# EAGLE schematic Paulo V2 (EAGLE 7.6.0)
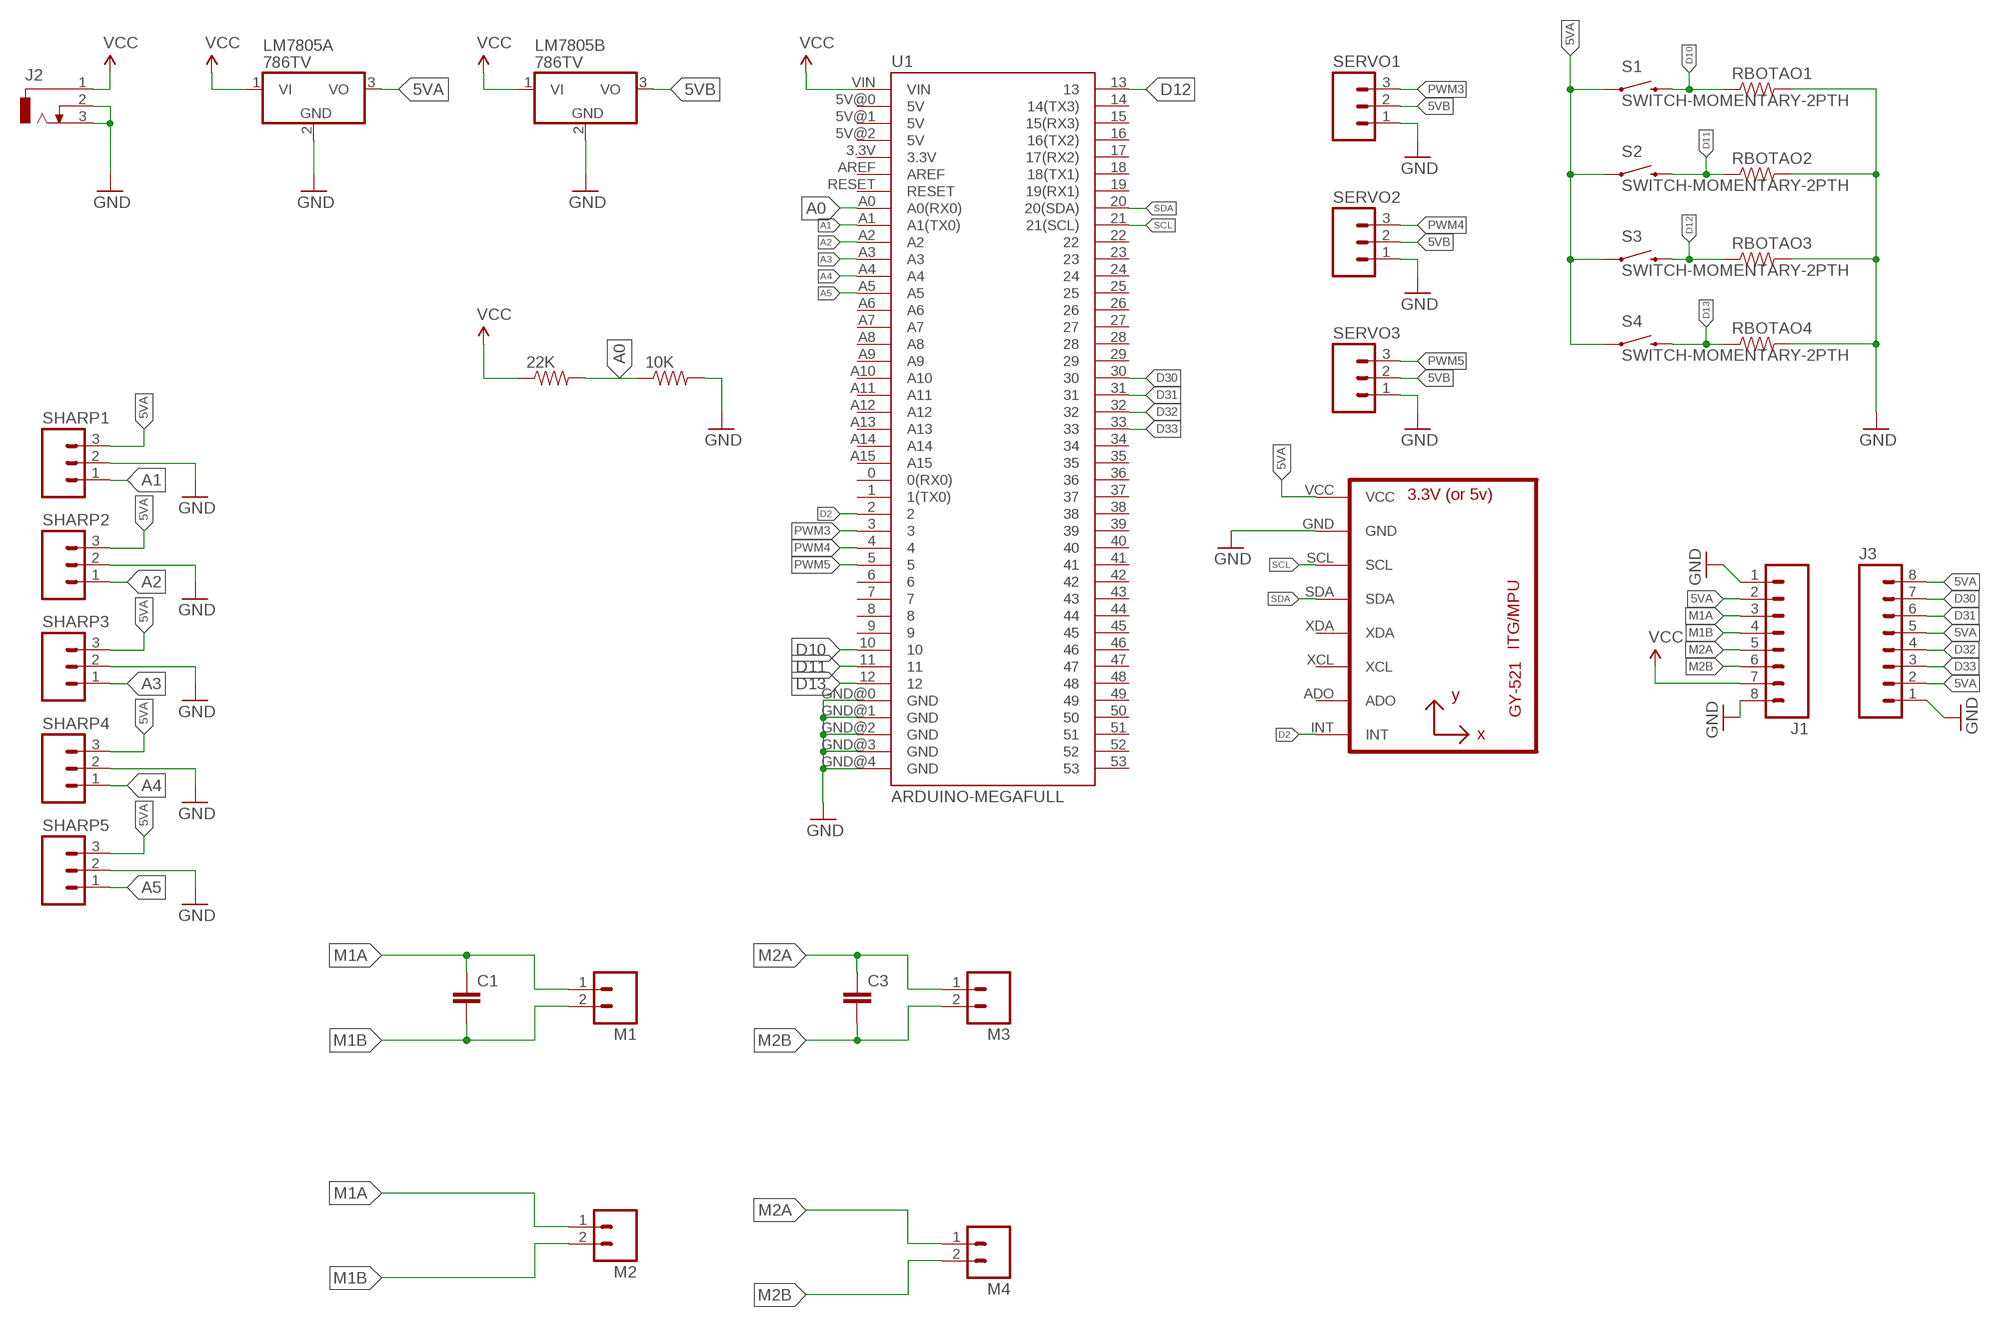
[diagram p0: schematic, sheet 1]

## Parts
10K  RESISTOREZ  [AXIAL-0.3EZ]
22K  RESISTOREZ  [AXIAL-0.3EZ]
C1  CAPEZ  [CAP-PTH-SMALLEZ]
C3  CAPEZ  [CAP-PTH-SMALLEZ]
J1  M08NO_SILK  [1X08_PIN1_NO_SILK]
J2  DCJ0303  [DCJ0303]
J3  M08NO_SILK  [1X08_PIN1_NO_SILK]
LM7805A  786TV  [TO220V]
LM7805B  786TV  [TO220V]
M1  M02JST-PTH-VERT  [JST-2-PTH-VERT]
M2  M02JST-PTH-VERT  [JST-2-PTH-VERT]
M3  M02JST-PTH-VERT  [JST-2-PTH-VERT]
M4  M02JST-PTH-VERT  [JST-2-PTH-VERT]
RBOTAO1  RESISTOREZ  [AXIAL-0.3EZ]
RBOTAO2  RESISTOREZ  [AXIAL-0.3EZ]
RBOTAO3  RESISTOREZ  [AXIAL-0.3EZ]
RBOTAO4  RESISTOREZ  [AXIAL-0.3EZ]
S1  SWITCH-MOMENTARY-2PTH  [TACTILE-PTH]
S2  SWITCH-MOMENTARY-2PTH  [TACTILE-PTH]
S3  SWITCH-MOMENTARY-2PTH  [TACTILE-PTH]
S4  SWITCH-MOMENTARY-2PTH  [TACTILE-PTH]
SERVO1  M03LONGPADS  [1X03_LONGPADS]
SERVO2  M03LONGPADS  [1X03_LONGPADS]
SERVO3  M03LONGPADS  [1X03_LONGPADS]
SHARP1  M03LONGPADS  [1X03_LONGPADS]
SHARP2  M03LONGPADS  [1X03_LONGPADS]
SHARP3  M03LONGPADS  [1X03_LONGPADS]
SHARP4  M03LONGPADS  [1X03_LONGPADS]
SHARP5  M03LONGPADS  [1X03_LONGPADS]
U1  ARDUINO-MEGAFULL  [ARDUINO_MEGA]
U2  GY-521MPU6050  [GY-521]

## Nets
5VA: J1.2 J3.2 J3.5 J3.8 LM7805A.3(VO) S1.1 S2.1 S3.1 S4.1 SHARP1.3 SHARP2.3 SHARP3.3 SHARP4.3 SHARP5.3 U2.VCC
5VB: LM7805B.3(VO) SERVO1.2 SERVO2.2 SERVO3.2
A0: 10K.P$1 22K.P$2 U1.A0(A0(RX0))
A1: SHARP1.1 U1.A1(A1(TX0))
A2: SHARP2.1 U1.A2
A3: SHARP3.1 U1.A3
A4: SHARP4.1 U1.A4
A5: SHARP5.1 U1.A5
D2: U1.2 U2.INT
D10: RBOTAO1.P$1 S1.3 U1.10
D11: RBOTAO2.P$1 S2.3 U1.11
D12: RBOTAO3.P$1 S3.3 U1.13
D13: RBOTAO4.P$1 S4.3 U1.12
D30: J3.7 U1.30
D31: J3.6 U1.31
D32: J3.4 U1.32
D33: J3.3 U1.33
GND: 10K.P$2 J1.1 J1.8 J2.2 J2.3 J3.1 LM7805A.2(GND) LM7805B.2(GND) RBOTAO1.P$2 RBOTAO2.P$2 RBOTAO3.P$2 RBOTAO4.P$2 SERVO1.1 SERVO2.1 SERVO3.1 SHARP1.2 SHARP2.2 SHARP3.2 SHARP4.2 SHARP5.2 U1.GND@0(GND) U1.GND@1(GND) U1.GND@2(GND) U1.GND@3(GND) U1.GND@4(GND) U2.GND
M1A: C1.1 J1.3 M1.1 M2.1
M1B: C1.2 J1.4 M1.2 M2.2
M2A: C3.1 J1.5 M3.1 M4.1
M2B: C3.2 J1.6 M3.2 M4.2
PWM3: SERVO1.3 U1.3
PWM4: SERVO2.3 U1.4
PWM5: SERVO3.3 U1.5
SCL: U1.21(21(SCL)) U2.SCL
SDA: U1.20(20(SDA)) U2.SDA
VCC: 22K.P$1 J1.7 J2.1 LM7805A.1(VI) LM7805B.1(VI) U1.VIN
Unconnected: U1.0(0(RX0)) U1.1(1(TX0)) U1.3.3V U1.5V@0(5V) U1.5V@1(5V) U1.5V@2(5V) U1.6 U1.7 U1.8 U1.9 U1.14(14(TX3)) U1.15(15(RX3)) U1.16(16(TX2)) U1.17(17(RX2)) U1.18(18(TX1)) U1.19(19(RX1)) U1.22 U1.23 U1.24 U1.25 U1.26 U1.27 U1.28 U1.29 U1.34 U1.35 U1.36 U1.37 U1.38 U1.39 U1.40 U1.41 U1.42 U1.43 U1.44 U1.45 U1.46 U1.47 U1.48 U1.49 U1.50 U1.51 U1.52 U1.53 U1.A6 U1.A7 U1.A8 U1.A9 U1.A10 U1.A11 U1.A12 U1.A13 U1.A14 U1.A15 U1.AREF U1.RESET U2.ADO U2.XCL U2.XDA

## Library data of the parts
10K 22K RBOTAO1-RBOTAO4 = SparkFun-Passives:RESISTOR: Resistor Basic schematic elements and footprints for 0603, 1206, and PTH resistors.
C1 C3 = SparkFun-Capacitors:CAP: Capacitor Standard 0603 ceramic capacitor, and 0.1" leaded capacitor.
J1 J3 = SparkFun-Connectors:M08: Header 8 Standard 8-pin 0.1" header. Use with straight break away headers (SKU : PRT-00116), right angle break away headers (PRT-00553), swiss pins (PRT-00743), machine pins (PRT-00117), and female headers (PRT-00115).
J2 = con-jack:DCJ0303: DC POWER JACK Source: DCJ0303.pdf; OC_FARNELL: unknown; OC_NEWARK: unknown
LM7805A LM7805B = linear:78*: Positive VOLTAGE REGULATOR Source: http://cache.national.com/ds/LM/LM78L05.pdf http://www.fairchildsemi.com/ds/LM/LM7805.pdf
M1-M4 = SparkFun-Connectors:M02: Standard 2-pin 0.1" header. Use with - straight break away headers ( PRT-00116) - right angle break away headers (PRT-00553) - swiss pins (PRT-00743) - machine pins (PRT-00117) - female headers (PRT-00115) Molex polarized connector foot print use with: PRT-08233 with associated crimp pins and housings. 2.54_SCREWTERM for use with PRT-10571. 3.5mm Screw Terminal footprints for PRT-08084 5mm Screw Terminal footprints for use with PRT-08432
S1-S4 = SparkFun-Electromechanical:SWITCH-MOMENTARY-2: Various NO switches- pushbuttons, reed, etc; PROD_ID: SWCH-08441
SERVO1-SERVO3 SHARP1-SHARP5 = SparkFun-Connectors:M03: Header 3 Standard 3-pin 0.1" header. Use with straight break away headers (SKU : PRT-00116), right angle break away headers (PRT-00553), swiss pins (PRT-00743), machine pins (PRT-00117), and female headers (PRT-00115). Molex polarized connector foot print use with SKU : PRT-08232 with associated crimp pins and housings.
U1 = SparkFun-Boards:ARDUINO-MEGA: Arduino Mega board footprint
U2 = gy-521:GY-521